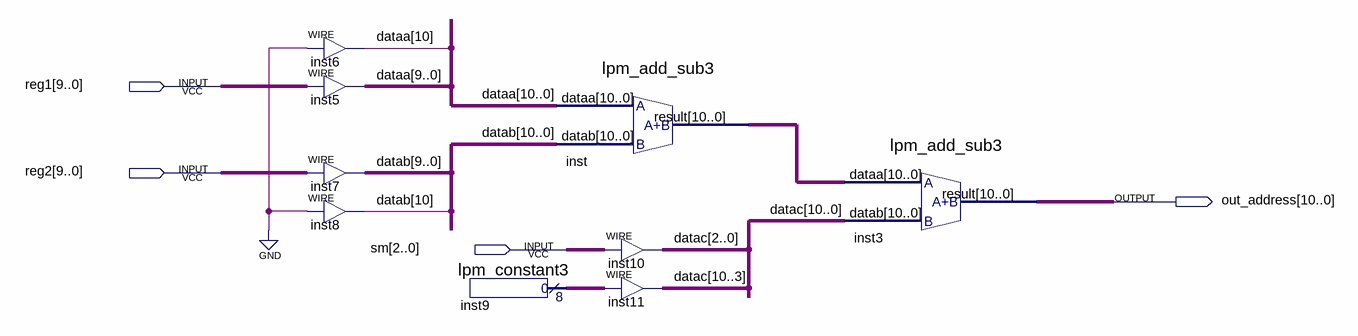
[diagram p0: schematic sheet]
// Quartus schematic RegSm.bdf as structural Verilog: 9 symbols, 4 pins
module RegSm (
  input  [9:0] reg1,
  input  [9:0] reg2,
  input  [2:0] sm,
  output [10:0] out_address
);

  wire [7:0] inst9_result;
  wire [10:0] dataa, datab, datac, inst_result;

  assign dataa[10] = 1'b0;  // WIRE inst6
  assign dataa[9:0] = reg1;  // WIRE inst5
  assign datab[9:0] = reg2;  // WIRE inst7
  assign datab[10] = 1'b0;  // WIRE inst8
  lpm_constant3 inst9 (.result(inst9_result));
  lpm_add_sub3 inst (.dataa(dataa), .datab(datab), .result(inst_result));
  assign datac[2:0] = sm;  // WIRE inst10
  assign datac[10:3] = inst9_result;  // WIRE inst11
  lpm_add_sub3 inst3 (.dataa(inst_result), .datab(datac), .result(out_address));
endmodule
